# EAGLE design omicron1_smd (EAGLE 8.6.0)
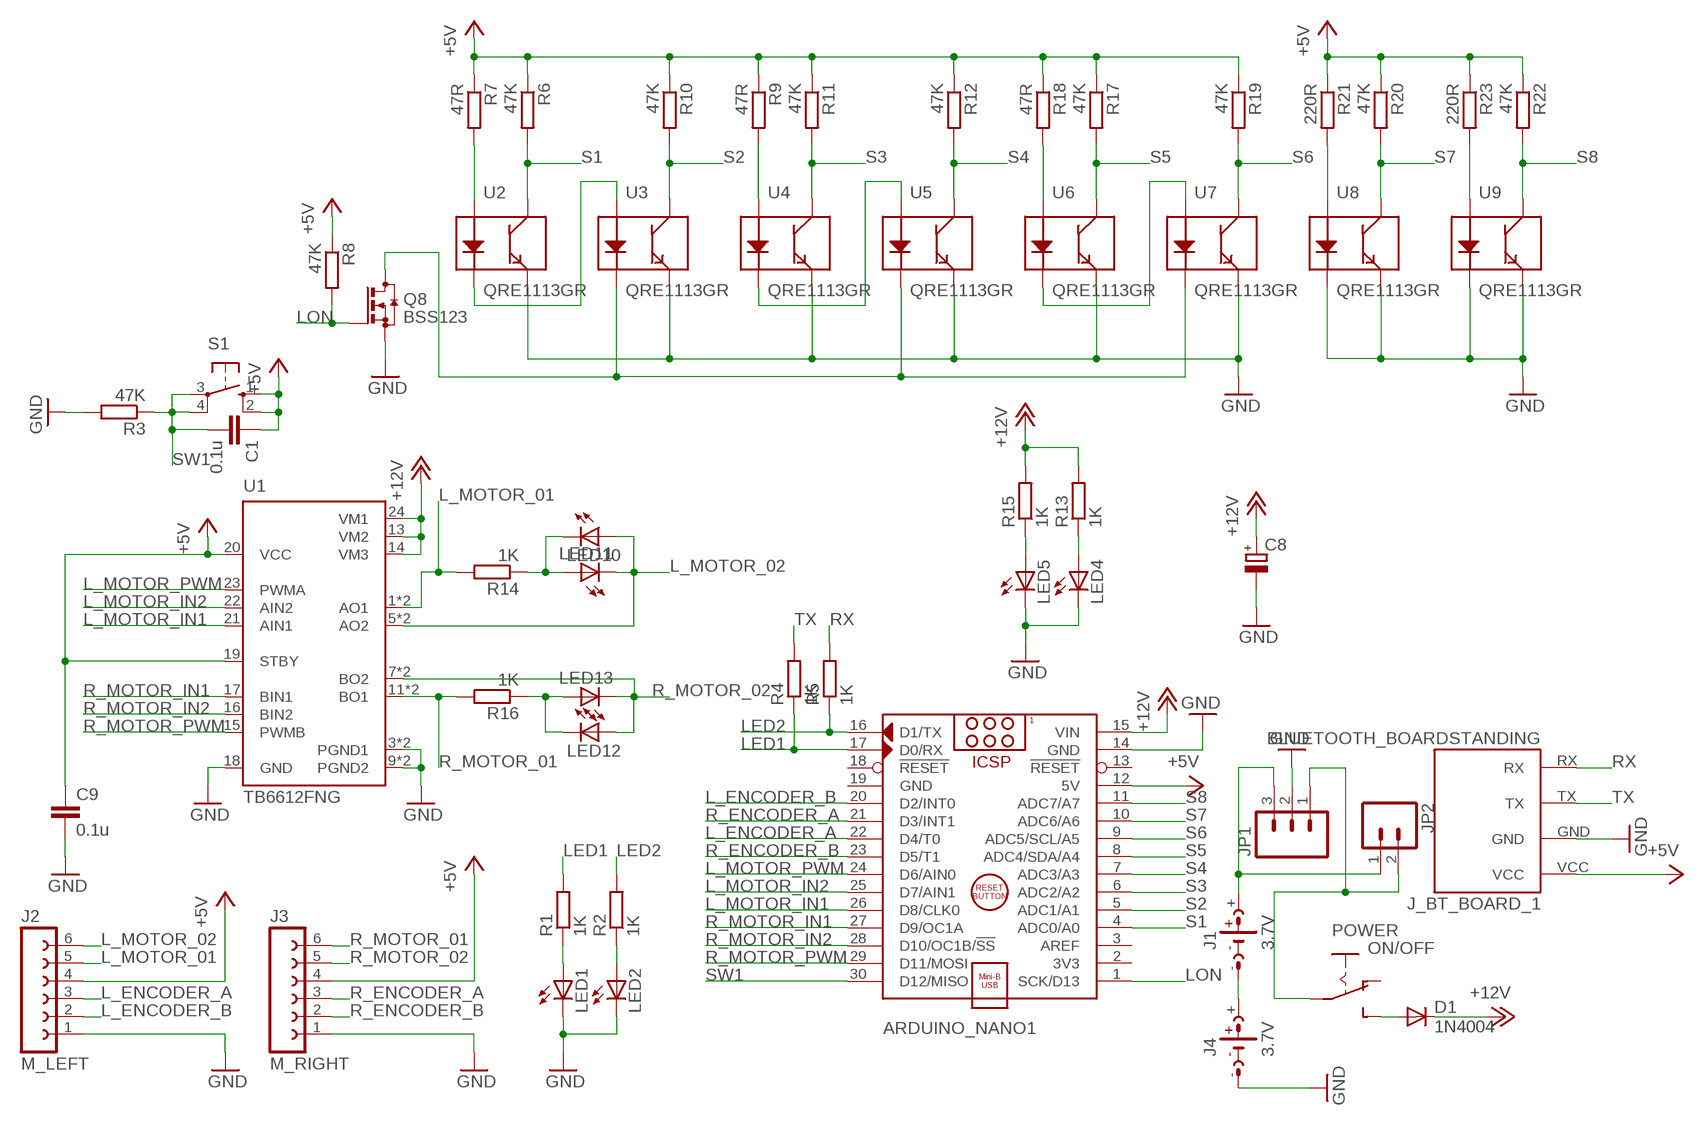
[diagram p0: schematic, sheet 1]

## Parts
ARDUINO_NANO1  ARDUINO_NANO  [ARDUINO_NANO]
C1  0.1u  C-EUC0805  [C0805]
C8  CPOL-EUE2,5-6E  [E2,5-6E]
C9  0.1u  C-EUC0805  [C0805]
D1  1N4004  [DO41-10]
J1  3.7V  BATTERY  [BATTERY]
J2  M_LEFT  FE06-12MM  [CON6-1_2MM]
J3  M_RIGHT  FE06-12MM  [CON6-1_2MM]
J4  3.7V  BATTERY  [BATTERY]
J_BT_BOARD_1  BLUETOOTH_BOARDSTANDING  [BT_BOARD_FOOTPRINT_STANDING]
JP1  M03PTH  [1X03]
JP2  M02PTH  [1X02]
LED1  LEDCHIP-LED0805  [CHIP-LED0805]
LED2  LEDCHIP-LED0805  [CHIP-LED0805]
LED4  LEDCHIP-LED0805  [CHIP-LED0805]
LED5  LEDCHIP-LED0805  [CHIP-LED0805]
LED10  LEDCHIP-LED0805  [CHIP-LED0805]
LED11  LEDCHIP-LED0805  [CHIP-LED0805]
LED12  LEDCHIP-LED0805  [CHIP-LED0805]
LED13  LEDCHIP-LED0805  [CHIP-LED0805]
POWER  ON/OFF  SWITCHS  [SWITCH]
Q8  BSS123  [SOT23]
R1  1K  R-EU_R0805  [R0805]
R2  1K  R-EU_R0805  [R0805]
R3  47K  R-EU_R0805  [R0805]
R4  1K  R-EU_R0805  [R0805]
R5  1K  R-EU_R0805  [R0805]
R6  47K  R-EU_R0805  [R0805]
R7  47R  R-EU_R0805  [R0805]
R8  47K  R-EU_R0805  [R0805]
R9  47R  R-EU_R0805  [R0805]
R10  47K  R-EU_R0805  [R0805]
R11  47K  R-EU_R0805  [R0805]
R12  47K  R-EU_R0805  [R0805]
R13  1K  R-EU_R0805  [R0805]
R14  1K  R-EU_R0805  [R0805]
R15  1K  R-EU_R0805  [R0805]
R16  1K  R-EU_R0805  [R0805]
R17  47K  R-EU_R0805  [R0805]
R18  47R  R-EU_R0805  [R0805]
R19  47K  R-EU_R0805  [R0805]
R20  47K  R-EU_R0805  [R0805]
R21  220R  R-EU_R0805  [R0805]
R22  47K  R-EU_R0805  [R0805]
R23  220R  R-EU_R0805  [R0805]
S1  10-XX  [B3F-10XX]
U1  TB6612FNG  [SSOP24]
U2  QRE1113GR  QRE1113  [QRE1113]
U3  QRE1113GR  QRE1113  [QRE1113]
U4  QRE1113GR  QRE1113  [QRE1113]
U5  QRE1113GR  QRE1113  [QRE1113]
U6  QRE1113GR  QRE1113  [QRE1113]
U7  QRE1113GR  QRE1113  [QRE1113]
U8  QRE1113GR  QRE1113  [QRE1113]
U9  QRE1113GR  QRE1113  [QRE1113]

## Nets
+5V: ARDUINO_NANO1.12(5V) C1.1 C9.1 J2.4 J3.4 J_BT_BOARD_1.VCC R6.1 R7.1 R8.1 R9.1 R10.1 R11.1 R12.1 R17.1 R18.1 R19.1 R20.1 R21.1 R22.1 R23.1 S1.1(S) S1.2(S1) U1.19(STBY) U1.20(VCC)
+12V: ARDUINO_NANO1.15(VIN) C8.+ D1.C R13.2 R15.2 U1.13(VM2) U1.14(VM3) U1.24(VM1)
GND: ARDUINO_NANO1.14(GND) C8.- C9.2 J2.1 J3.1 J4.- J_BT_BOARD_1.GND JP1.2 LED1.C LED2.C LED4.C LED5.C Q8.2(S) R3.2 U1.3(PGND1) U1.4(PGND1) U1.9(PGND2) U1.10(PGND2) U1.18(GND) U2.4(E) U3.4(E) U4.4(E) U5.4(E) U6.4(E) U7.4(E) U8.2(K) U8.4(E) U9.2(K) U9.4(E)
L_ENCODER_A: ARDUINO_NANO1.22(D4/T0) J2.3
L_ENCODER_B: ARDUINO_NANO1.20(D2/INT0) J2.2
L_MOTOR_01: J2.5 R14.2 U1.1(AO1) U1.2(AO1)
L_MOTOR_02: J2.6 LED10.A LED11.C U1.5(AO2) U1.6(AO2)
L_MOTOR_IN1: ARDUINO_NANO1.26(D8/CLK0) U1.21(AIN1)
L_MOTOR_IN2: ARDUINO_NANO1.25(D7/AIN1) U1.22(AIN2)
L_MOTOR_PWM: ARDUINO_NANO1.24(D6/AIN0) U1.23(PWMA)
LED1: ARDUINO_NANO1.17(D0/RX) R1.2 R4.1
LED2: ARDUINO_NANO1.16(D1/TX) R2.2 R5.1
LINE_K2: Q8.3(D) U3.2(K) U5.2(K) U7.2(K)
LON: ARDUINO_NANO1.1(SCK/D13) Q8.1(G) R8.2
N$1: R23.2 U9.1(A)
N$2: R21.2 U8.1(A)
N$3: J1.- J4.+
N$4: LED1.A R1.1
N$5: LED2.A R2.1
N$6: D1.A POWER.S
N$7: J1.+ JP1.3 JP2.1
N$8: LED5.A R15.1
N$9: LED4.A R13.1
N$10: LED10.C LED11.A R14.1
N$11: JP1.1 JP2.2 POWER.P
N$13: LED12.C LED13.A R16.1
N$33: R7.2 U2.1(A)
N$34: U2.2(K) U3.1(A)
N$35: U4.2(K) U5.1(A)
N$36: U6.2(K) U7.1(A)
N$42: R18.2 U6.1(A)
N$55: R9.2 U4.1(A)
R_ENCODER_A: ARDUINO_NANO1.21(D3/INT1) J3.3
R_ENCODER_B: ARDUINO_NANO1.23(D5/T1) J3.2
R_MOTOR_01: J3.6 R16.2 U1.11(BO1) U1.12(BO1)
R_MOTOR_02: J3.5 LED12.A LED13.C U1.7(BO2) U1.8(BO2)
R_MOTOR_IN1: ARDUINO_NANO1.27(D9/OC1A) U1.17(BIN1)
R_MOTOR_IN2: ARDUINO_NANO1.28(D10/OC1B/!SS) U1.16(BIN2)
R_MOTOR_PWM: ARDUINO_NANO1.29(D11/MOSI) U1.15(PWMB)
RX: J_BT_BOARD_1.RX R5.2
S1: ARDUINO_NANO1.4(ADC0/A0) R6.2 U2.3(C)
S2: ARDUINO_NANO1.5(ADC1/A1) R10.2 U3.3(C)
S3: ARDUINO_NANO1.6(ADC2/A2) R11.2 U4.3(C)
S4: ARDUINO_NANO1.7(ADC3/A3) R12.2 U5.3(C)
S5: ARDUINO_NANO1.8(ADC4/SDA/A4) R17.2 U6.3(C)
S6: ARDUINO_NANO1.9(ADC5/SCL/A5) R19.2 U7.3(C)
S7: ARDUINO_NANO1.10(ADC6/A6) R20.2 U8.3(C)
S8: ARDUINO_NANO1.11(ADC7/A7) R22.2 U9.3(C)
SW1: ARDUINO_NANO1.30(D12/MISO) C1.2 R3.1 S1.3(P) S1.4(P1)
TX: J_BT_BOARD_1.TX R4.2
Unconnected: ARDUINO_NANO1.2(3V3) ARDUINO_NANO1.3(AREF) ARDUINO_NANO1.13(!RESET) ARDUINO_NANO1.18(!RESET) POWER.O

## Power pins joined to a net without a drawn wire
GND: ARDUINO_NANO1.19(GND)

## Library data of the parts
ARDUINO_NANO1 = ArduinoNanoV30:ARDUINO_NANO: Arduino Nano V3.0 Module Overview: The Arduino Nano is a small, complete, and breadboard-friendly board based on the ATmega328 (Arduino Nano 3.x) or ATmega168 (Arduino Nano 2.x). It has more or less the same functionality of the Arduino Duemilanove, but in a different package. It lacks only a DC power jack, and works with a Mini-B USB cable instead of a standard one. The Nano was designed and is being produced by Gravitech <http://www.gravitech.us/arna30wiatp.html>. General specifications: Item Value Microcontroller Atmel ATmega168 or ATmega328 Operating Voltage (logic level) 5 V Input Voltage (recommended) 7-12 V Input Voltage (limits) 6-20 V Digital I/O Pins 14 (of which 6 provide PWM output) Analog Input Pins 8 DC Current per I/O Pin 40 mA Flash Memory 16 KB (ATmega168) or 32 KB (ATmega328) of which 2 KB used by bootloader SRAM 1 KB (ATmega168) or 2 KB (ATmega328) EEPROM 512 bytes (ATmega168) or 1 KB (ATmega328) Clock Speed 16 MHz Dimensions (Inches) 0.73" x 1.70" Dimensions (mm) 18mm x 45mm Overall height About 9 mm (not including pins) Weigth 5 g Power: The Arduino Nano can be powered via the Mini-B USB connection, 6-20V unregulated external power supply (pin 30), or 5V regulated external power supply (pin 27). The power source is automatically selected to the highest voltage source. Memory: The ATmega168 has 16 KB of flash memory for storing code (of which 2 KB is used for the bootloader); the ATmega328 has 32 KB, (also with 2 KB used for the bootloader). The ATmega168 has 1 KB of SRAM and 512 bytes of EEPROM (which can be read and written with the EEPROM library); the ATmega328 has 2 KB of SRAM and 1 KB of EEPROM. Input and Output: Each of the 14 digital pins on the Nano can be used as an input or output, using pinMode(), digitalWrite(), and digitalRead() functions. They operate at 5 volts. Each pin can provide or receive a maximum of 40 mA and has an internal pull-up resistor (disconnected by default) of 20-50 kOhms. In addition, some pins have specialized functions. Visit Arduino - ArduinoBoardNano <https://www.arduino.cc/en/Main/ArduinoBoardNano>
C1 C9 = rcl:C-EU: CAPACITOR, European symbol
C8 = resistor:CPOL-EU: POLARIZED CAPACITOR, European symbol
D1 = diode:1N4004: DIODE general purpose rectifier, 1 A
J1 J4 = pololu:BATTERY: BATTERY CLIP
J2 J3 = pololu:FE06-1: FEMALE HEADER
J_BT_BOARD_1 = Bluetooth HC-05:BLUETOOTH_BOARD: Bluetooth Board V1.05
JP1 = SparkFun:M03: Header 3 Standard 3-pin 0.1" header. Use with straight break away headers (SKU : PRT-00116), right angle break away headers (PRT-00553), swiss pins (PRT-00743), machine pins (PRT-00117), and female headers (PRT-00115). Molex polarized connector foot print use with SKU : PRT-08232 with associated crimp pins and housings.
JP2 = SparkFun:M02: Header 2 Standard 2-pin 0.1" header. Use with straight break away headers (SKU : PRT-00116), right angle break away headers (PRT-00553), swiss pins (PRT-00743), machine pins (PRT-00117), and female headers (PRT-00115). Molex polarized connector foot print use with SKU : PRT-08233 with associated crimp pins and housings.
LED1 LED2 LED4 LED5 LED10-LED13 = led:LED: LED OSRAM: - CHIPLED LG R971, LG N971, LY N971, LG Q971, LY Q971, LO R971, LY R971 LH N974, LH R974 LS Q976, LO Q976, LY Q976 LO Q996 - Hyper CHIPLED LW Q18S LB Q993, LB Q99A, LB R99A - SideLED LS A670, LO A670, LY A670, LG A670, LP A670 LB A673, LV A673, LT A673, LW A673 LH A674 LY A675 LS A676, LA A676, LO A676, LY A676, LW A676 LS A679, LY A679, LG A679 - Hyper Micro SIDELED® LS Y876, LA Y876, LO Y876, LY Y876 LT Y87S - SmartLED LW L88C, LW L88S LB L89C, LB L89S, LG L890 LS L89K, LO L89K, LY L89K LS L896, LA L896, LO L896, LY L896 - TOPLED LS T670, LO T670, LY T670, LG T670, LP T670 LSG T670, LSP T670, LSY T670, LOP T670, LYG T670 LG T671, LOG T671, LSG T671 LB T673, LV T673, LT T673, LW T673 LH T674 LS T676, LA T676, LO T676, LY T676, LB T676, LH T676, LSB T676, LW T676 LB T67C, LV T67C, LT T67C, LS T67K, LO T67K, LY T67K, LW E67C LS E67B, LA E67B, LO E67B, LY E67B, LB E67C, LV E67C, LT E67C LW T67C LS T679, LY T679, LG T679 LS T770, LO T770, LY T770, LG T770, LP T770 LB T773, LV T773, LT T773, LW T773 LH T774 LS E675, LA E675, LY E675, LS T675 LS T776, LA T776, LO T776, LY T776, LB T776 LHGB T686 LT T68C, LB T68C - Hyper Mini TOPLED® LB M676 - Mini TOPLED Santana® LG M470 LS M47K, LO M47K, LY M47K Source: http://www.osram.convergy.de LUXEON: - LUMILED® LXK2-PW12-R00, LXK2-PW12-S00, LXK2-PW14-U00, LXK2-PW14-V00 LXK2-PM12-R00, LXK2-PM12-S00, LXK2-PM14-U00 LXK2-PE12-Q00, LXK2-PE12-R00, LXK2-PE12-S00, LXK2-PE14-T00, LXK2-PE14-U00 LXK2-PB12-K00, LXK2-PB12-L00, LXK2-PB12-M00, LXK2-PB14-N00, LXK2-PB14-P00, LXK2-PB14-Q00 LXK2-PR12-L00, LXK2-PR12-M00, LXK2-PR14-Q00, LXK2-PR14-R00 LXK2-PD12-Q00, LXK2-PD12-R00, LXK2-PD12-S00 LXK2-PH12-R00, LXK2-PH12-S00 LXK2-PL12-P00, LXK2-PL12-Q00, LXK2-PL12-R00 Source: www.luxeon.com KINGBRIGHT: KA-3528ASYC Source: www.kingbright.com
POWER = pololu:SWITCH: SLIDING SWITCH 0.1" spacing through hole, vertical SPDT slide switch http://www.ladyada.net/library/pcb/eaglelibrary.html
Q8 = transistor-small-signal:BSS123: N-CHANNEL MOS FET
R1-R23 = rcl:R-EU_: RESISTOR, European symbol
S1 = switch-omron:10-XX: OMRON SWITCH
U1 = pololu:TB6612FNG
U2-U9 = pololu:QRE1113

## Board
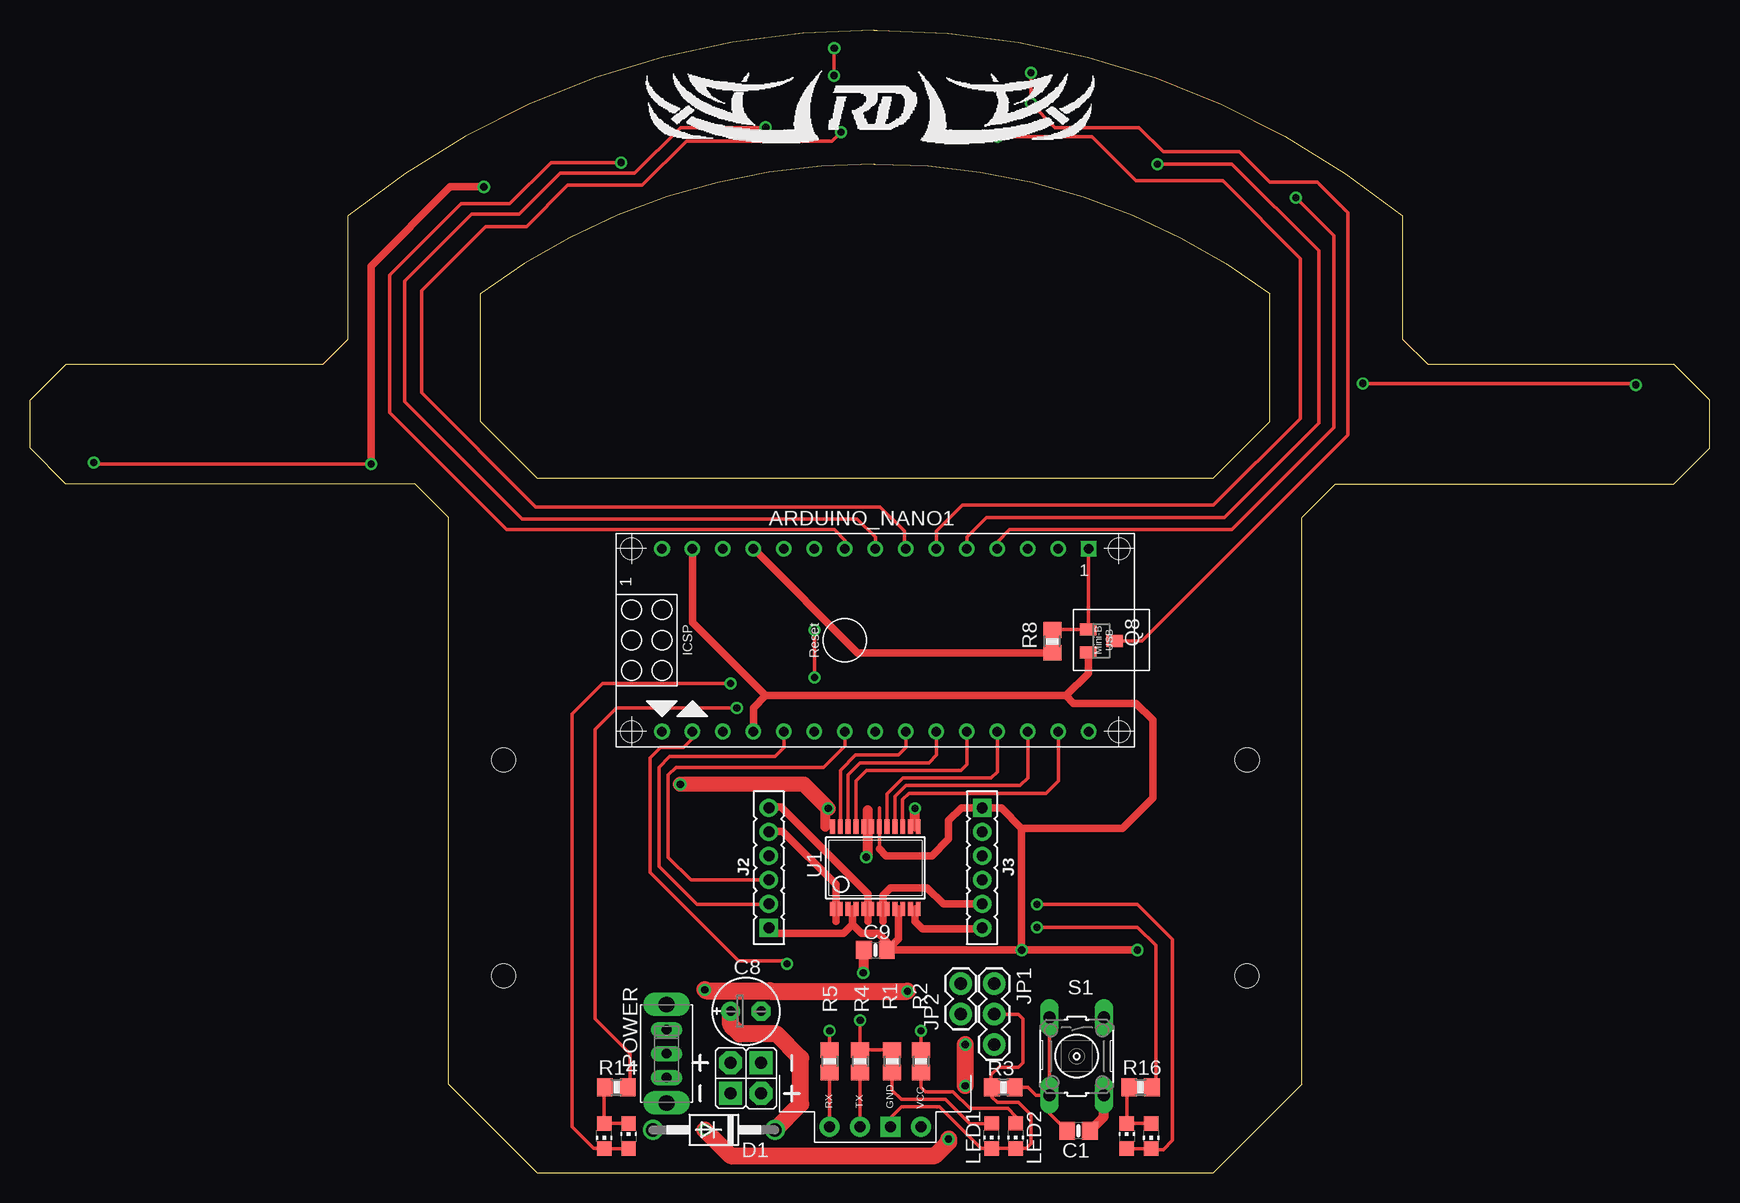
[diagram p1: board, top side]
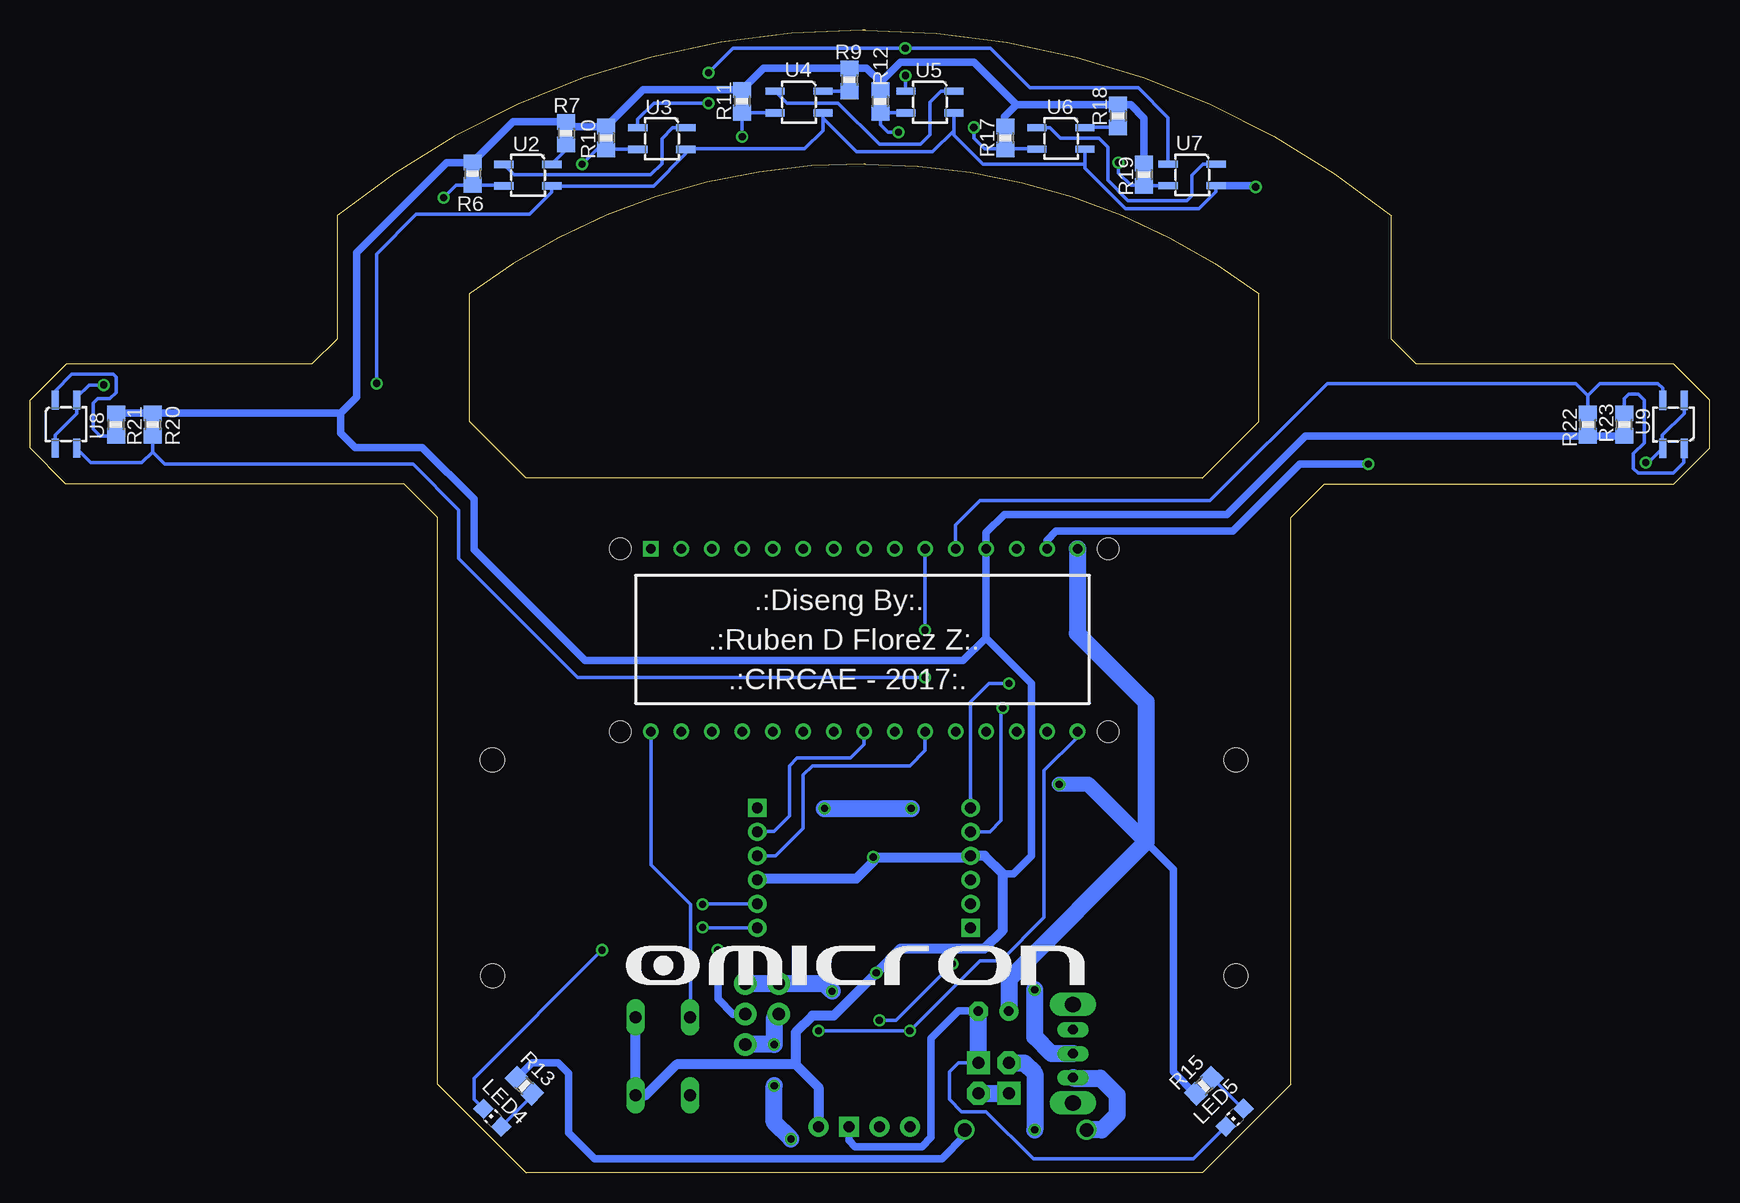
[diagram p2: board, bottom side, seen from below]

Size 140 x 95.25 mm. Coordinates in mm from the lower left corner, seen from the top.
Outline: 42.28,0 98.67,0 106.03,7.37 106.03,54.61 108.83,57.4 137.02,57.4 140,60.38 140,64.38 137,67.38 116.5,67.38 114.41,69.47 114.41,79.76 arc39 70.6,95.25 70.34,95.25 arc39 26.53,79.76 26.53,69.47 24.44,67.38 3,67.38 0,64.38 0,60.38 2.98,57.4 32.12,57.4 34.91,54.61 34.91,7.37 42.28,0
Outline: 42.28,57.91 37.58,62.61 37.58,73.28 arc-37 70.34,84.07 70.47,84.07 arc-37 103.36,73.28 103.36,62.61 98.67,57.91 42.28,57.91
Copper layers (1*16): Top 0.035mm / dielectric 1.5mm / Bottom 0.035mm
Design rules "default": minimum track width 8mil, minimum drill 19mil, track to track 8mil, track to pad 8mil, pad to pad 8mil, via to via 8mil, smd to smd 8mil, copper to edge 10mil, drill to drill 8mil, minimum pad ring 10mil, minimum via ring 8mil, stop-mask expansion 4mil, vias tented up to drill 20mil, thermal gap 10mil
Holes 2 mm at 39.48,16.4 101.44,16.4 39.49,34.4 101.45,34.4

### Footprints (pad centres in the part's own frame; a part is rotated, then mirrored left to right if it is on the bottom)
ARDUINO_NANO = drill 0.8 square: 1 -20.32,-7.62 | drill 0.8: 2 -17.78,-7.62; 3 -15.24,-7.62; 4 -12.7,-7.62; 5 -10.16,-7.62; 6 -7.62,-7.62; 7 -5.08,-7.62; 8 -2.54,-7.62; 9 0,-7.62; 10 2.54,-7.62; 11 5.08,-7.62; 12 7.62,-7.62; 13 10.16,-7.62; 14 12.7,-7.62; 15 15.24,-7.62; 16 15.24,7.62; 17 12.7,7.62; 18 10.16,7.62; 19 7.62,7.62; 20 5.08,7.62; 21 2.54,7.62; 22 0,7.62; 23 -2.54,7.62; 24 -5.08,7.62; 25 -7.62,7.62; 26 -10.16,7.62; 27 -12.7,7.62; 28 -15.24,7.62; 29 -17.78,7.62; 30 -20.32,7.62 | hole 1.778: -22.86,-7.62; -22.86,7.62; 17.78,7.62; 17.78,-7.62
C0805 = smd 1.3 x 1.5: 1 -0.95,0; 2 0.95,0
E2,5-6E = drill 0.813 pad 1.575: + -1.27,0 | drill 0.813 pad 1.575 octagon: - 1.27,0
DO41-10 = drill 1.118: A 5.08,0; C -5.08,0
BATTERY = drill 1 pad 1.93 octagon: + 0,1.27 | drill 1 pad 1.93 square: - 0,-1.27
CON6-1_2MM = drill 0.9 pad 1.524 square: 1 -5,0 | drill 0.9 pad 1.524: 2 -3,0; 3 -1,0; 4 1,0; 5 3,0; 6 5,0
BT_BOARD_FOOTPRINT_STANDING = drill 0.9 pad 1.676 square: GND -3.81,-1.27 | drill 0.9 pad 1.676: RX -3.81,3.81; TX -3.81,1.27; VCC -3.81,-3.81
1X03 = drill 1.016 pad 1.88: 1 0,0; 2 2.54,0; 3 5.08,0
1X02 = drill 1.016 pad 1.88: 1 0,0; 2 2.54,0
CHIP-LED0805 = smd 1.2 x 1.2: A 0,-1.05; C 0,1.05
SWITCH = drill 0.8 pad 1.27 long: O -2,0; P 0,0; S 2,0 | drill 1.3 long: P$1 -4.1,0; P$2 4.1,0
SOT23 = smd 1 x 1.4: 1 -0.95,-1.1; 2 0.95,-1.1; 3 0,1.1
R0805 = smd 1.3 x 1.5: 1 -0.95,0; 2 0.95,0
B3F-10XX = drill 1.016 long: 1 -3.251,2.261; 2 3.251,2.261; 3 -3.251,-2.261; 4 3.251,-2.261
SSOP24 = smd 0.4 x 1.2: 1 -3.575,-3.42; 2 -2.925,-3.42; 3 -2.275,-3.42; 4 -1.625,-3.42; 5 -0.975,-3.42; 6 -0.325,-3.42; 7 0.325,-3.42; 8 0.975,-3.42; 9 1.625,-3.42; 10 2.275,-3.42; 11 2.925,-3.42; 12 3.575,-3.42; 13 3.575,3.42; 14 2.925,3.42; 15 2.275,3.42; 16 1.625,3.42; 17 0.975,3.42; 18 0.325,3.42; 19 -0.325,3.42; 20 -0.975,3.42; 21 -1.625,3.42; 22 -2.275,3.42; 23 -2.925,3.42; 24 -3.575,3.42
QRE1113 = smd 1.6 x 0.6: 1 -2,-0.9; 2 2,-0.9; 3 2,0.9; 4 -2,0.9

### Placement (x,y rotation side)
ARDUINO_NANO1  67.92,44.38 180 top
C1  87.41,3.49 180 top
C8  59.68,13.45 0 top
C9  70.47,18.54 0 top
D1  57.01,3.56 180 top
J1  58.41,7.87 0 top
J2  61.59,25.4 90 top
J3  79.37,25.4 270 top
J4  60.95,7.86 180 top
J_BT_BOARD_1  70.46,7.62 90 top
JP1  80.38,15.75 270 top
JP2  77.58,13.21 90 top
LED1  80.15,3.05 180 top
LED2  82.17,3.05 180 top
LED4  101.45,4.57 45 bottom
LED5  39.59,4.58 135 bottom
LED10  49.9,3.05 0 top
LED11  47.87,3.05 180 top
LED12  91.43,3.05 0 top
LED13  93.46,3.05 180 top
POWER  53.06,9.9 270 top
Q8  89.32,44.32 270 top
R1  71.87,9.27 90 top
R2  74.28,9.27 90 top
R3  81.14,7.11 180 top
R4  69.2,9.27 270 top
R5  66.66,9.27 270 top
R6  103.11,83.27 270 bottom
R7  95.3,86.65 270 bottom
R8  85.22,44.28 90 top
R9  71.68,91.1 270 bottom
R10  91.96,86.25 270 bottom
R11  80.64,89.31 270 bottom
R12  69.12,89.29 270 bottom
R13  98.79,7.24 135 bottom
R14  48.88,7.11 0 top
R15  42.15,7.24 225 bottom
R16  92.57,7.11 0 top
R17  58.7,86.25 270 bottom
R18  49.29,88.08 270 bottom
R19  47.13,83.19 270 bottom
R20  129.78,62.36 270 bottom
R21  132.83,62.36 270 bottom
R22  10.15,62.36 90 bottom
R23  7.1,62.36 90 bottom
S1  87.25,9.69 270 top
U1  70.47,25.4 0 top
U2  98.51,83.15 180 bottom
U3  87.34,86.19 180 bottom
U4  75.9,89.24 180 bottom
U5  64.98,89.24 180 bottom
U6  54.06,86.2 180 bottom
U7  43.13,83.16 180 bottom
U8  137,62.38 270 bottom
U9  3.01,62.38 90 bottom

### Tracks (layer width: path | path; a pad name or v marks a point on that pad's centre or on a via)
+5V  (via drill 0.6)
  Top 0.305: U1.20 69.84,28.82 U1.19
  Top 0.61: ARDUINO_NANO1.12 68.97,43.33 R8.1
  Top 0.813: v69.46,16.64 69.52,16.7 C9.1 | C1.1 89.51,4.65 S1.2 | v69.71,26.29 69.84,26.42 69.84,28.82 69.84,30.23
  Bottom 0.61: 60.31,44.58 60.3,44.59 ARDUINO_NANO1.12 60.31,52.02 60.31,53.34 58.79,54.86 40.25,54.86 33.7,61.41 R22.1 R23.1 | 60.31,44.58 56.5,40.77 56.5,26.42 58.03,24.89 58.92,24.89 | R17.1 58.79,87.29 58.79,88.01 57.77,89.03 | 57.77,89.03 R18.1 49.29,89.03 48.25,89.03 47.13,87.91 R19.1 | 69.12,90.89 67.42,92.58 61.31,92.58 57.77,89.03 | 69.12,90.89 R12.1 | R20.1 129.97,63.37 | 69.12,90.89 69.12,90.94 70.26,92.08 71.64,92.08 R9.1 78.83,92.05 78.84,92.06 R11.1 88.91,90.26 R10.1 94.9,87.2 R7.1 99.73,87.6 R6.1 103.13,84.2 105.27,84.2 112.76,76.71 112.76,64.64 114.1,63.31 | R21.1 R20.1 | R20.1 114.1,63.31 | 60.31,44.58 62.22,42.67 93.71,42.67 102.98,51.94 102.98,56.13 107.3,60.45 112.89,60.45 114.1,61.66 114.1,63.31
  Bottom 0.813: 60.31,51.99 ARDUINO_NANO1.12 | 89.26,12.94 S1.1 S1.2 88.67,6.44 86.09,9.02 76.19,9.02 | J3.4 79.27,24.51 71.11,24.51 69.71,25.91 v69.71,26.29 61.71,26.29 J2.4 60.43,26.4 58.92,24.89 58.92,20.19 60.44,18.67 67.42,18.67 v69.46,16.64 73.01,13.08 74.79,13.08 76.19,11.68 76.19,9.02 | J_BT_BOARD_1.VCC 74.28,3.82 74.28,7.11 76.19,9.02
+12V  (via drill 0.6)
  Top 0.406: U1.13 73.77,28.82 U1.14 | 66.28,28.83 66.29,28.82 U1.24
  Top 0.813: 73.77,28.82 v73.77,30.35 | v66.53,30.35 66.28,30.1 66.28,28.83
  Top 1.27: v66.53,30.35 64.53,32.36 v54.21,32.36
  Top 1.422: D1.C 64.25,5.72 64.25,9.52 62.22,11.56 59.17,11.56 58.41,12.32 C8.+
  Bottom 0.61: R15.2 42.88,6.57 44.69,8.38 44.69,25.27 46.98,27.56 | R13.2 99.39,7.91 98.16,9.14 96,9.14 95.11,8.25 95.11,3.3 92.95,1.14 64,1.14 62.09,3.05 D1.C
  Bottom 1.27: 46.98,27.56 51.77,32.36 v54.21,32.36
  Bottom 1.422: v73.77,30.35 70.85,30.35 v66.53,30.35 | ARDUINO_NANO1.15 52.69,51.99 52.69,44.96 46.98,39.24 46.98,27.56 58.41,16.12 C8.+
GND  (via drill 0.6)
  Top 0.305: v92.32,18.54 92.18,18.66 | J_BT_BOARD_1.GND 71.73,4.56 72.63,5.46 75.81,5.46 79.26,2 LED1.C | 70.85,28.76 U1.18 | 80.05,1.91 LED1.C | LED1.C LED2.C 82.2,2.03 83.05,2.03 83.43,2.41 83.43,4.83 82.41,5.84 80.63,5.84 80.19,6.28 R3.2 80.12,7.18 80.12,8.13 80.76,8.76 82.41,8.76 82.79,9.14 82.79,12.83 82.41,13.21 JP1.2 | v133.84,65.66 133.72,65.79 v111.11,65.79 | U1.4 68.57,21.98 U1.3 | 79.35,30.38 J3.1 79.42,30.35 | U1.18 70.8,26.98 | U1.18 70.8,30.41 | 5.45,59.05 v28.43,59.05
  Top 0.406: U1.9 72.38,21.98 U1.10
  Top 0.61: C9.2 v82.66,18.54 | v82.66,18.54 v92.32,18.54 | v82.66,18.54 82.66,28.7 | 70.8,26.98 71.37,26.42 75.17,26.42 76.57,27.81 76.57,29.34 77.64,30.4 J3.1 80.96,30.4 82.66,28.7 | 82.66,28.7 91.05,28.7 93.59,31.24 93.59,37.72 92.19,39.12 86.98,39.12 86.35,39.75 | 86.35,39.75 61.33,39.75 | 86.35,39.75 88.22,41.62 Q8.2 | 61.33,39.75 60.3,38.72 ARDUINO_NANO1.19 | 61.33,39.75 55.22,45.86 ARDUINO_NANO1.14 | C9.2 71.49,18.48 | v28.43,59.05 28.43,75.56 35.04,82.17 v37.83,82.17 | v5.32,59.18 5.45,59.05 | 68.57,21.98 68.57,20.7 | 68.57,20.7 67.81,19.94 62.06,19.94 J2.1 | C9.2 72.38,19.5 72.38,21.98 | 68.57,20.7 69.33,19.94 70.73,19.94 71.42,19.24 C9.2
  Bottom 0.305: v92.32,18.54 102.98,7.87 102.98,6.1 LED4.C | v133.84,65.66 135.07,65.66 136.1,64.63 U8.4 136.1,63.28 137.91,61.47 137.91,60.4 U8.2 | v111.11,65.79 111.11,76.58 107.81,79.88 98.37,79.88 96.51,81.74 U2.4 88.04,82.25 85.34,84.95 U3.4 85.28,85.34 75.42,85.34 73.9,86.87 73.9,87.88 | 62.98,86.87 64.76,85.09 71.11,85.09 73.9,87.88 | 62.98,86.87 62.98,86.49 60.57,84.07 52.06,84.07 | 73.9,87.88 U4.4 | 52.06,84.07 U6.4 | 52.06,84.07 52.06,83.72 48.68,80.34 42.58,80.34 41.13,81.79 U7.4 41.04,82.17 | 3.91,60.26 U9.4 | U9.4 3.92,60.39 3.92,61.47 2.11,63.28 U9.2 | U5.4 62.98,86.87 | LED5.C 43.02,1.14 56.38,1.14 60.31,5.08 62.34,5.08 63.36,6.1 63.36,8.38 62.61,9.13 J4.- | U9.4 5.1,59.18 v5.32,59.18
  Bottom 0.61: J_BT_BOARD_1.GND 71.74,3.79 71.74,2.67 71.23,2.16 65.65,2.16 64.88,2.92 64.88,11.18 62.6,13.46 60.96,13.46 C8.- | ARDUINO_NANO1.14 55.23,52.02 55.23,52.7 54.47,53.47 39.74,53.47 34.15,59.05 v28.43,59.05 | v37.83,82.17 37.92,82.26 U7.4 | JP1.2 81.39,13.21 82.66,14.48 v82.66,18.54
  Bottom 1.422: J4.- C8.-
L_ENCODER_A
  Top 0.305: J2.3 61.57,24.38 55.11,24.38 53.2,26.29 53.2,33.15 53.84,33.78 66.15,33.78 67.92,35.55 ARDUINO_NANO1.22
L_ENCODER_B
  Top 0.305: J2.2 61.54,22.35 55.61,22.35 52.44,25.53 52.44,33.78 53.33,34.67 62.09,34.67 62.84,35.42 ARDUINO_NANO1.20
L_MOTOR_01  (via drill 0.6)
  Top 0.305: U1.2 67.17,21.98 U1.1 67.17,21.71 | R14.2 50.03,7.31 50.03,9.91 47.1,12.83 47.1,36.96 48.88,38.73 v58.92,38.73
  Top 0.61: J2.5 61.64,28.45 62.73,28.45 67.17,24 67.17,21.98 | 67.17,21.71 67.17,20.96
  Bottom 0.305: v58.92,38.73 59.04,38.61 59.04,29.34 59.98,28.4 J2.5
L_MOTOR_02  (via drill 0.6)
  Top 0.305: LED10.A LED11.C 47.83,2.03 46.98,2.03 45.2,3.81 45.2,38.23 47.74,40.77 v58.41,40.77 | U1.6 69.84,21.98 U1.5
  Top 0.61: J2.6 61.67,30.48 62.6,30.48 69.84,23.24 69.84,21.98 69.84,20.96
  Bottom 0.305: v58.41,40.77 60.06,40.77 61.59,39.23 J2.6
L_MOTOR_IN1
  Top 0.305: ARDUINO_NANO1.26 78.09,36.75 78.09,34.04 77.58,33.53 69.71,33.53 68.85,32.66 U1.21
L_MOTOR_IN2
  Top 0.305: ARDUINO_NANO1.25 75.55,36.75 75.55,34.8 74.92,34.16 69.2,34.16 68.2,33.16 U1.22
L_MOTOR_PWM
  Top 0.305: ARDUINO_NANO1.24 73.01,36.75 73.01,35.43 72.38,34.8 68.82,34.8 67.55,33.52 U1.23
LED1  (via drill 0.6)
  Top 0.305: ARDUINO_NANO1.17 55.23,36.75 | v63.11,17.4 62.85,17.65 59.04,17.65 51.68,25.02 51.68,34.54 52.56,35.43 54.47,35.43 55.22,36.18 ARDUINO_NANO1.17 | R1.2 R4.1 v69.2,12.7 | ARDUINO_NANO1.17
  Bottom 0.305: v69.2,12.7 67.81,12.7 v63.11,17.4
LED2  (via drill 0.6)
  Top 0.305: R2.2 v74.28,11.81 | v66.66,11.81 R5.1
  Bottom 0.305: v74.28,11.81 v66.66,11.81 60.82,17.65 59.06,17.65 | 59.06,17.65 59.04,17.65 | 59.06,17.65 55.46,21.25 55.46,33.51 52.68,36.29 ARDUINO_NANO1.16
LINE_K2  (via drill 0.6)
  Top 0.305: v83.43,91.69 v83.43,89.15 85.46,87.12 92.44,87.12 94.48,85.09 100.83,85.09 103.36,82.55 107.3,82.55 109.84,80.01 109.84,61.47 92.7,44.32 Q8.3 | v67.01,91.45 67.04,91.48 v67.04,93.73
  Bottom 0.305: v83.43,89.15 88,89.15 89.34,87.81 U3.2 | v83.43,91.69 81.39,93.73 v67.04,93.73 59.93,93.73 56.63,90.42 47.61,90.42 45.13,87.94 U7.2 | U5.2 67.01,90.17 v67.01,91.45
LON
  Top 0.305: Q8.1 88.24,45.29 ARDUINO_NANO1.1 | Q8.1 88.18,45.23 | R8.2 85.25,45.27 Q8.1
N$1
  Bottom 0.305: U9.1 2.15,60.34 2.15,59.18 3.04,58.29 5.96,58.29 6.34,58.67 6.34,59.94 5.45,60.83 5.45,64.39 5.96,64.9 6.72,64.9 7.1,64.52 R23.2
N$2
  Bottom 0.305: U8.1 137.9,65.16 136.51,66.55 133.08,66.55 132.83,66.29 132.83,65.02 133.34,64.52 134.35,64.52 134.73,64.13 134.73,61.98 134.16,61.41 R21.2
N$3
  Bottom 1.422: J4.+ 58.42,6.59 J1.-
N$4
  Top 0.305: LED1.A 80.11,4.06 78.35,4.06 76.31,6.1 72.63,6.1 71.87,6.86 R1.1
N$5
  Top 0.305: LED2.A 82.16,4.12 82.16,4.7 81.52,5.33 78.35,5.33 76.95,6.73 74.66,6.73 74.28,7.11 R2.1
N$6
  Bottom 1.422: 53.03,7.87 POWER.S 53.03,7.87 | 53.03,7.87 50.79,7.87 49.39,6.48 49.39,4.83 50.66,3.56 D1.A
N$7  (via drill 0.6)
  Top 1.422: v56.25,3.56 58.41,1.4 75.42,1.4 76.57,2.54 v76.57,2.79 | v77.97,7.24 v77.97,10.67
  Bottom 1.422: J1.+ 57.14,9.14 56.25,8.25 v56.25,3.56 | v76.57,2.79 77.97,4.19 v77.97,7.24 | JP1.3 v77.97,10.67 77.97,12.83 JP2.1
N$8
  Bottom 0.305: LED5.A 38.89,5.32 R15.1
N$9
  Bottom 0.305: LED4.A 98.12,6.42 R13.1
N$10
  Top 0.305: LED10.C LED11.A 47.87,7.05 R14.1
N$11  (via drill 0.6)
  Top 1.422: v56.25,15.24 56.34,15.15 61.66,15.15 61.7,15.11 v73.14,15.11
  Bottom 1.422: POWER.P 54.85,9.91 56.25,11.3 v56.25,15.24 | 77.71,15.75 JP1.1 | 77.71,15.75 JP2.2 | v73.14,15.11 73.77,15.75 77.71,15.75
N$13
  Top 0.305: LED13.A LED12.C 91.43,6.92 R16.1
N$33
  Bottom 0.305: U2.1 95.3,85.25 R7.2
N$34
  Bottom 0.305: U2.2 99.64,83.18 88.25,83.18 87.33,84.11 87.33,86.2 86.44,87.09 U3.1
N$35
  Bottom 0.305: U4.2 76.92,89.15 72.63,89.15 69.2,85.72 65.77,85.72 64.97,86.53 64.97,89.22 64.05,90.14 U5.1
N$36
  Bottom 0.305: U6.2 54.96,87.1 54.09,86.23 50.91,86.23 50.15,85.47 50.15,82.72 48.46,81.03 43.55,81.03 43.13,81.44 43.13,83.16 42.23,84.06 U7.1
N$42
  Bottom 0.305: U6.1 52.03,87.13 R18.2
N$55
  Bottom 0.305: U4.1 R9.2
R_ENCODER_A
  Bottom 0.305: ARDUINO_NANO1.21 65.38,35.19 66.66,33.91 74.79,33.91 75.55,33.15 75.55,28.7 77.84,26.42 79.36,26.42 | 79.36,26.42 J3.3 79.36,26.42
R_ENCODER_B
  Bottom 0.305: ARDUINO_NANO1.23 70.46,35.7 71.62,34.54 76.06,34.54 76.7,33.91 76.7,29.72 77.97,28.45 79.33,28.45 | 79.33,28.45 J3.2 79.33,28.45
R_MOTOR_01  (via drill 0.6)
  Top 0.305: U1.11 73.77,21.98 U1.12 | R16.2 93.84,7.43 93.84,18.92 92.32,20.45 v83.93,20.45
  Top 0.61: J3.6 79.29,20.32 74.41,20.32 73.77,20.96 73.77,21.98
  Bottom 0.305: v83.93,20.45 83.89,20.4 J3.6
R_MOTOR_02  (via drill 0.6)
  Top 0.305: LED12.A LED13.C 93.55,1.91 94.48,1.91 95.24,2.67 95.24,19.43 92.32,22.35 v83.93,22.35 | U1.8 71.11,21.98 U1.7 71.11,21.67
  Top 0.61: 71.11,21.98 71.11,23.11 71.74,23.75 74.79,23.75 76.14,22.4 J3.5 | 71.11,21.67 71.11,20.96
  Bottom 0.305: v83.93,22.35 83.88,22.4 J3.5
R_MOTOR_IN1
  Top 0.305: ARDUINO_NANO1.27 80.63,36.75 80.63,33.4 80.12,32.89 72.76,32.89 71.45,31.58 U1.17
R_MOTOR_IN2
  Top 0.305: ARDUINO_NANO1.28 83.17,36.75 83.17,32.89 82.54,32.26 73.01,32.26 72.1,31.34 U1.16
R_MOTOR_PWM
  Top 0.305: ARDUINO_NANO1.29 85.71,36.75 85.71,32.64 84.7,31.62 73.27,31.62 72.75,31.1 U1.15
RX
  Top 0.305: R5.2 66.65,8.31 J_BT_BOARD_1.RX
S1  (via drill 0.6)
  Top 0.305: ARDUINO_NANO1.4 80.63,52.02 80.63,52.58 81.65,53.59 100.19,53.59 108.7,62.1 108.7,78.1 v105.52,81.28
  Bottom 0.305: v105.52,81.28 104.48,82.32 R6.2 100.58,82.32 U2.3
S2  (via drill 0.6)
  Top 0.305: ARDUINO_NANO1.5 78.09,52.02 78.09,52.96 79.74,54.61 99.56,54.61 107.43,62.48 107.43,76.83 100.19,84.07 v93.97,84.07
  Bottom 0.305: v93.97,84.07 92.74,85.3 R10.2 91.95,85.29 U3.3
S3  (via drill 0.6)
  Top 0.305: ARDUINO_NANO1.6 75.55,52.02 75.55,53.47 77.71,55.63 98.67,55.63 105.91,62.87 105.91,76.2 99.43,82.68 92.19,82.68 88.51,86.36 v80.63,86.36
  Bottom 0.305: v80.63,86.36 v80.64,86.37 R11.2 80.62,88.34 U4.3
S4  (via drill 0.6)
  Top 0.305: ARDUINO_NANO1.7 72.89,52.12 72.89,53.47 70.85,55.5 42.15,55.5 32.63,65.02 32.63,73.53 37.96,78.87 41.39,78.87 44.82,82.3 51.04,82.3 54.72,85.98 61.84,85.98 66.87,85.98 v67.61,86.72
  Bottom 0.305: U5.3 R12.2 69.12,87.37 68.46,86.71 68.45,86.72 v67.61,86.72
S5  (via drill 0.6)
  Top 0.305: ARDUINO_NANO1.8 70.47,52.02 70.47,52.96 68.95,54.48 41.01,54.48 31.23,64.26 31.23,74.29 36.82,79.88 40.75,79.88 44.18,83.31 50.41,83.31 54.22,87.12 v61.33,87.12
  Bottom 0.305: 58.74,85.34 R17.2 | 58.74,85.34 60.44,85.34 61.33,86.23 v61.33,87.12 | U6.3 56.1,85.34 58.74,85.34
S6  (via drill 0.6)
  Top 0.305: ARDUINO_NANO1.9 67.93,52.02 67.93,52.7 67.04,53.59 39.74,53.59 29.96,63.37 29.96,74.8 35.93,80.77 39.99,80.77 43.42,84.2 v49.26,84.2
  Bottom 0.305: 47.12,82.25 R19.2 | R19.2 47.19,82.3 48.25,82.3 49.26,83.31 v49.26,84.2 | R19.2 47.11,82.26 U7.3
S7  (via drill 0.6)
  Top 0.305: v65.39,45.21 v65.39,41.27
  Bottom 0.305: v65.39,45.21 65.38,45.22 ARDUINO_NANO1.10 | v65.39,41.27 94.35,41.27 104.25,51.18 104.25,55.24 108.06,59.05 128.76,59.05 129.78,60.07 | U8.3 136.1,60.33 134.94,59.18 130.67,59.18 129.78,60.07 | R20.2 129.78,60.07
S8
  Bottom 0.305: ARDUINO_NANO1.11 62.84,53.99 60.82,56.01 41.64,56.01 31.86,65.79 11.16,65.79 10.15,64.77 | R22.2 10.15,64.77 | 3.92,64.39 U9.3 3.91,65.39 4.3,65.79 9.13,65.79 10.15,64.77
SW1
  Top 0.305: C1.2 84.99,4.96 S1.4 | R3.1 83.17,7.11 83.84,6.44 S1.4 | S1.4 S1.3
  Bottom 0.305: S1.3 84.95,12.98 84.95,22.35 88.24,25.64 ARDUINO_NANO1.30
TX
  Top 0.305: J_BT_BOARD_1.TX 69.2,3.82 R4.2

### Text on the board
bPlace: .:Diseng By:. | .:Ruben D Florez Z:. | .:CIRCAE - 2017:.